# Altium schematic sheet PLD_Flash-Memory.SchDoc: Flash Memory
size A4; ApprovedBy: Piotr Kuligowski; CheckedBy: Piotr Kuligowski; Author: Michał Gumiela; SheetNumber: 12; SheetTotal: 13
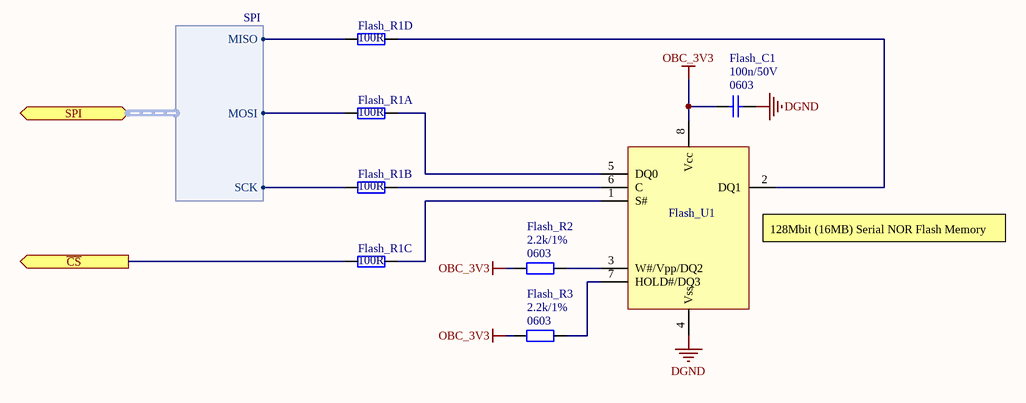
[diagram p0: PLD_Flash-Memory.SchDoc]

## Parts
Flash_C1  Package: 0603  [SMD_Capacitor_0603]  (hidden comment: 100n/50V)
Flash_R1  100R  [SMD_RESISTOR_ARRAY_YC124]  (parts A,B,C,D of 4)
Flash_R2  Package: 0603  [SMD_Resistor_0603]  (hidden comment: 2.2k/1%)
Flash_R3  Package: 0603  [SMD_Resistor_0603]  (hidden comment: 2.2k/1%)
Flash_U1  (no value)  [DIP8 ADAPTER]

## Ports
SPI (harness SPI), ~{CS} (out)

## Harnesses
SPI: MISO, MOSI, SCK

## Nets
DGND: Flash_C1.1 Flash_U1.4(Vss)
OBC_3V3: Flash_C1.2 Flash_R2.2 Flash_R3.2 Flash_U1.8(Vcc)
~{CS}: Flash_R1.6 ; port ~{CS}
NetFlash_R1_1: Flash_R1.1 Flash_U1.5(DQ0)
NetFlash_R1_2: Flash_R1.2 Flash_U1.6(C)
NetFlash_R1_3: Flash_R1.3 Flash_U1.1(S#)
NetFlash_R1_4: Flash_R1.4 Flash_U1.2(DQ1)
NetFlash_R1_5: Flash_R1.5 ; port SPI.MISO
NetFlash_R1_7: Flash_R1.7 ; port SPI.SCK
NetFlash_R1_8: Flash_R1.8 ; port SPI.MOSI
NetFlash_R2_1: Flash_R2.1 Flash_U1.3(W#/Vpp/DQ2)
NetFlash_R3_1: Flash_R3.1 Flash_U1.7(HOLD#/DQ3)

## Notes on the sheet
- (near Flash_U1) 128Mbit (16MB) Serial NOR Flash Memory
- Title:
- Project:
- Author:
- Model:
- Document Number:
- Checked by:
- Rev:
- Date:
- Approved by:
- Sheet:
- of
- File name:

## Library data of the parts
Flash_C1 = Cer_C0603T104K5RALTU: Ceramic Cap Kemet COTS 100n/50V X7R 0603; Manufacturer: Kemet; ManufacturerPartNumber: C0603T104K5RALTU; Value: 100n/50V
Flash_R1 = 4ResPack: RESISTOR ARRAY, 4 x 0402; URL: http://pl.farnell.com/yageo-phycomp/yc124-jr-072k2l/resistor-array-arv341-4-x-0402/dp/9235388; value: 100R
Flash_R2 Flash_R3 = CRCW06032K20FKxxxx: 2.2k/1% Vishay CRCW 0603 Resistor. 100mW, 100ppm, 75V.; ManufacturerPartNumber: CRCW06032K20FKxxxx; Manufacturer: Vishay; Value: 2.2k/1%
Flash_U1 = N25Q128A13ESE40G: 128Mbit, 3V Serial NOR Flash Memory; Manufacturer: Micron; ManufacturerPartNumber: N25Q128A13ESE40G